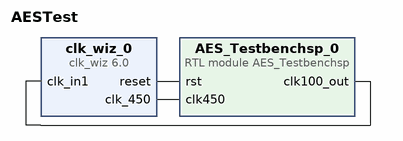
[diagram p0: block diagram of the top level]
# Vivado block design AESTest, xc7a35ticpg236-1L, Vivado 2023.2.1
create_bd_design AESTest

create_bd_cell -type ip -vlnv xilinx.com:ip:clk_wiz:6.0 clk_wiz_0
set_property -dict [list \
  CONFIG.CLKOUT1_JITTER 98.066 \
  CONFIG.CLKOUT1_PHASE_ERROR 97.646 \
  CONFIG.CLKOUT1_REQUESTED_OUT_FREQ 450 \
  CONFIG.CLK_OUT1_PORT clk_450 \
  CONFIG.MMCM_CLKFBOUT_MULT_F 10.125 \
  CONFIG.MMCM_CLKOUT0_DIVIDE_F 2.250 \
] [get_bd_cells clk_wiz_0]
create_bd_cell -type module -reference AES_Testbenchsp AES_Testbenchsp_0

# ---- connections ----

connect_bd_net [get_bd_pins AES_Testbenchsp_0/clk100_out] [get_bd_pins clk_wiz_0/clk_in1]
connect_bd_net [get_bd_pins clk_wiz_0/reset] [get_bd_pins AES_Testbenchsp_0/rst]
connect_bd_net [get_bd_pins clk_wiz_0/clk_450] [get_bd_pins AES_Testbenchsp_0/clk450]

validate_bd_design
save_bd_design
